# Altium project SmartHome.PrjPcb
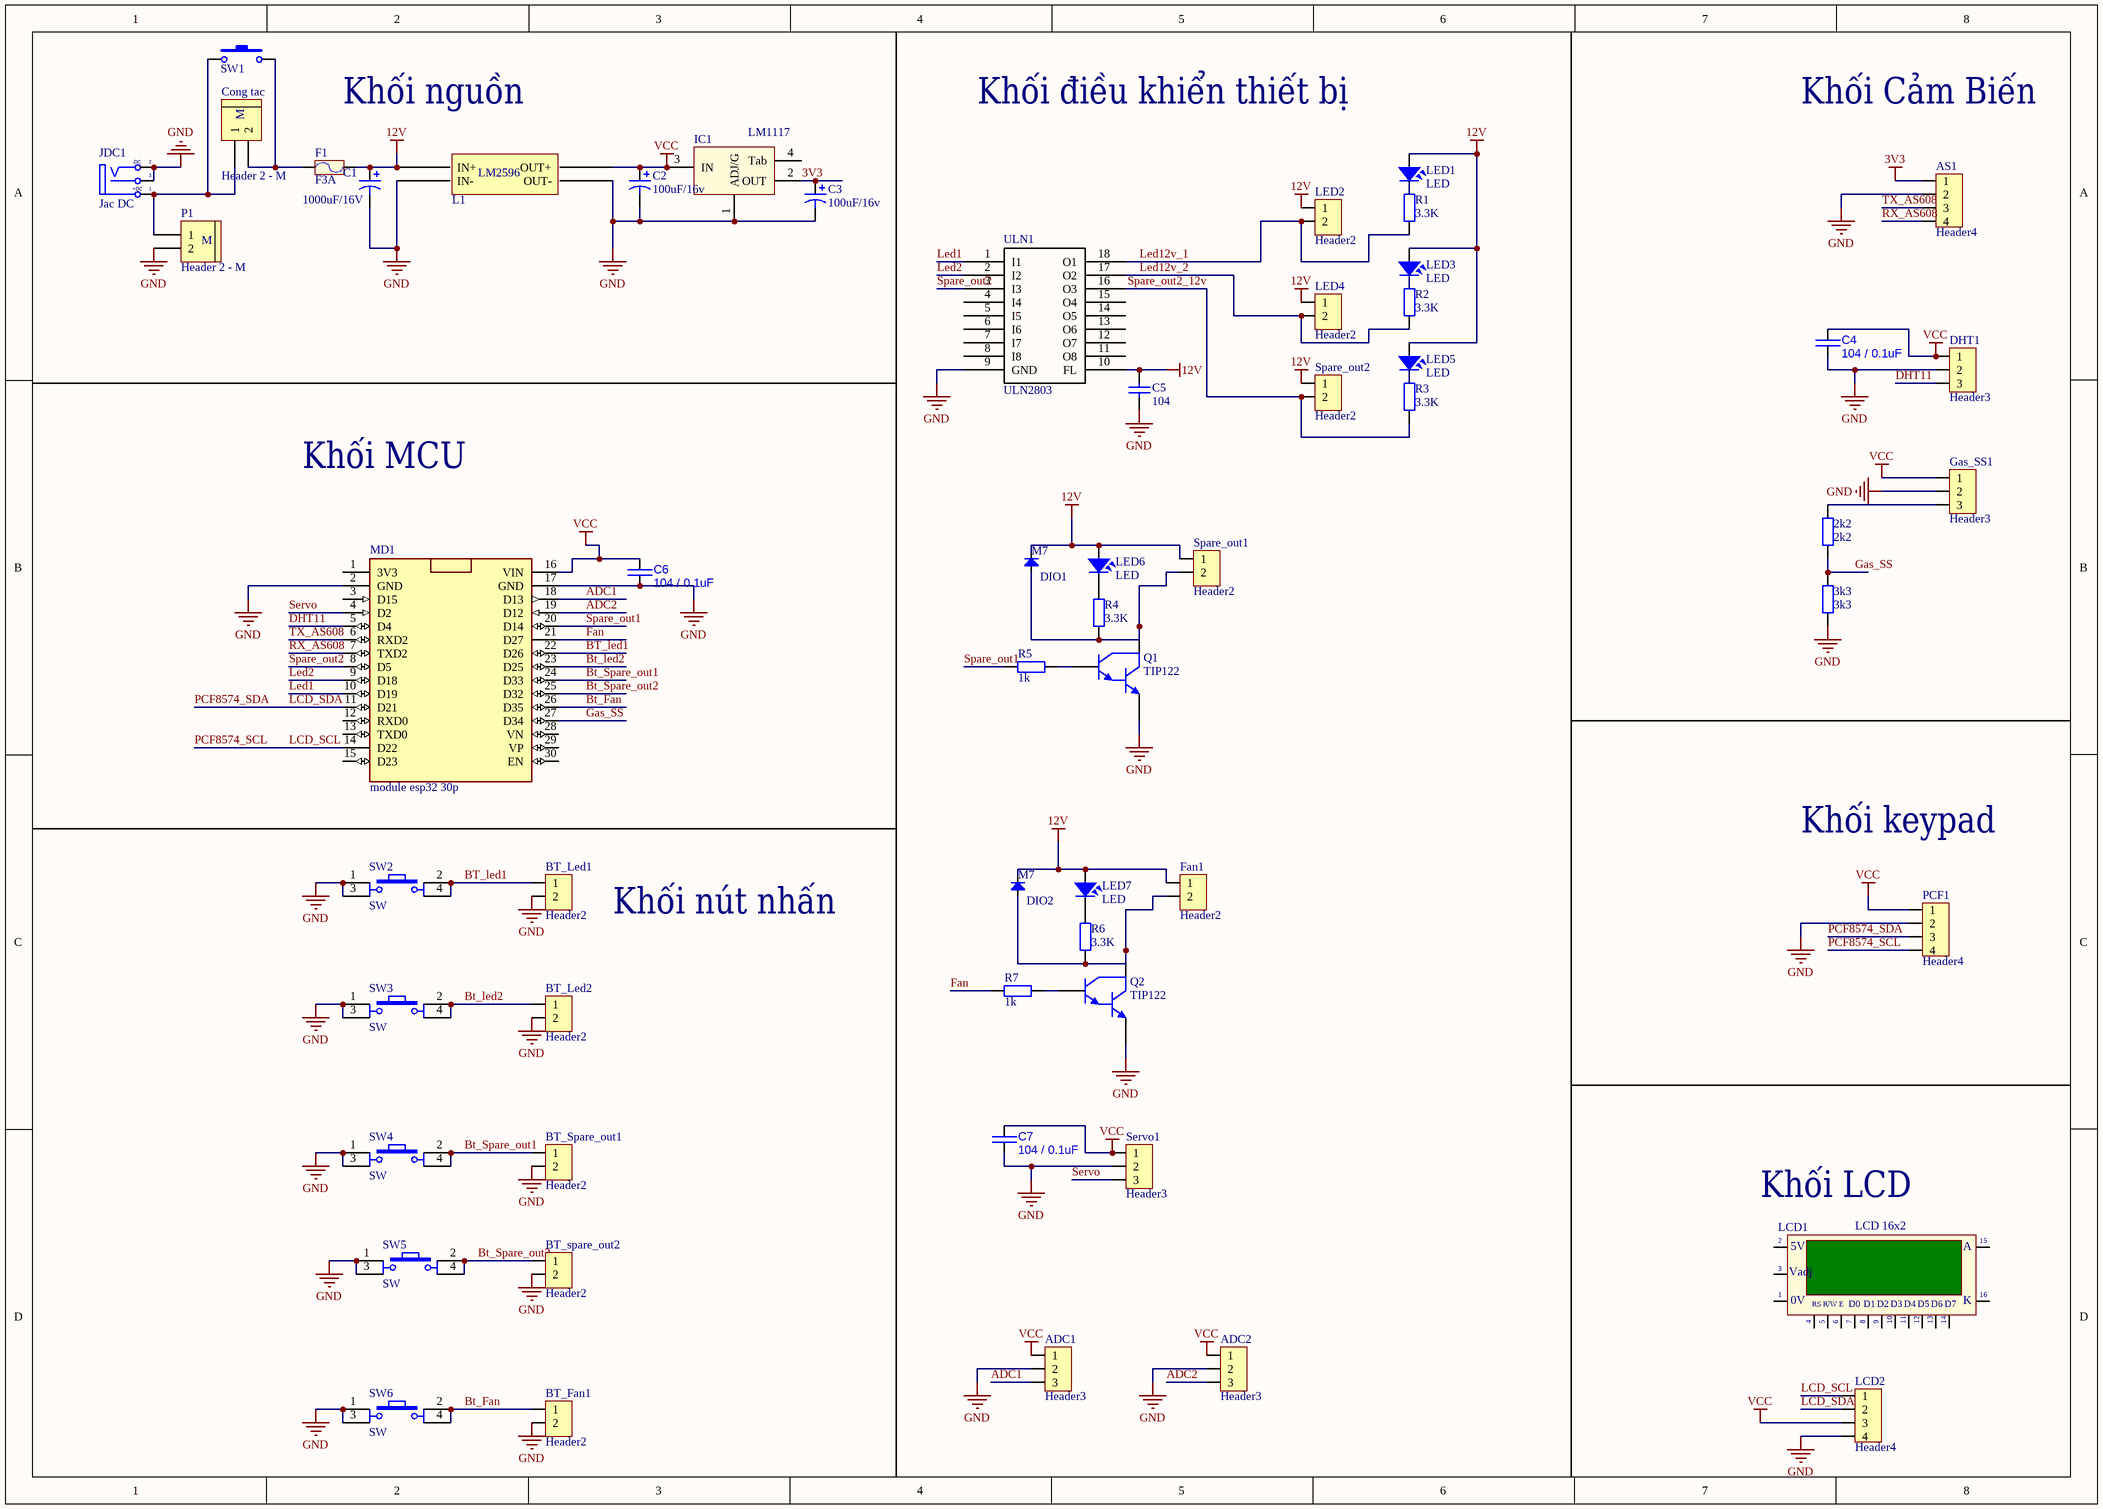
[diagram p0: SmartHome.SchDoc]
1 sheet, 58 parts. Net scope: global (net labels, ports and power ports of the same name join across sheets).
Board file: SmartHome.PcbDoc

## Sheet SmartHome.SchDoc
size A3

### Parts
2k2  2k2  [DIEN TRO 0805]
3k3  3k3  [DIEN TRO 0805]
ADC1  Header3  [Header3]
ADC2  Header3  [Header3]
AS1  Header4  [Header4]
BT_Fan1  Header2  [Header2]
BT_Led1  Header2  [Header2]
BT_Led2  Header2  [Header2]
BT_Spare_out1  Header2  [Header2]
BT_spare_out2  Header2  [Header2]
C1  1000uF/16V  [C10mm]
C2  100uF/16v  [C5mm]
C3  100uF/16v  [C5mm]
C4  value 104 / 0.1uF  [CAP_0805]  (hidden comment: approved sub OK)
C5  104  [C0805]
C6  value 104 / 0.1uF  [CAP_0805]  (hidden comment: approved sub OK)
C7  value 104 / 0.1uF  [CAP_0805]  (hidden comment: approved sub OK)
Cong_tac  Header 2 - M  [Medium - Header 2]
DHT1  Header3  [Header3]
DIO1  M7  [DIO-SMD-106]
DIO2  M7  [DIO-SMD-106]
F1  F3A  [Fuse]
Fan1  Header2  [Header2]
Gas_SS1  Header3  [Header3]
IC1  LM1117  [SOT223-4N]
JDC1  Jac DC  [DC-IN]
L1  BUCK_LM2596  [BUCK_LM2596]  (value not drawn)
LCD1  LCD 16x2  [LCD16X2N]
LCD2  Header4  [XH2.54M-4]
LED1  LED  [LED-5 GRe]
LED2  Header2  [Header2]
LED3  LED  [LED-5 GRe]
LED4  Header2  [Header2]
LED5  LED  [LED-5 GRe]
LED6  LED  [LED-5 GRe]
LED7  LED  [LED-5 GRe]
MD1  module esp32 30p  [module esp32 30 pin]
P1  Header 2 - M  [Medium - Header 2]
PCF1  Header4  [XH2.54M-4]
Q1  TIP122  [QTO-220]
Q2  TIP122  [QTO-220]
R1  3.3K  [DIEN TRO 0805]
R2  3.3K  [DIEN TRO 0805]
R3  3.3K  [DIEN TRO 0805]
R4  3.3K  [DIEN TRO 0805]
R5  1k  [DIEN TRO 0805]
R6  3.3K  [DIEN TRO 0805]
R7  1k  [DIEN TRO 0805]
Servo1  Header3  [Header3]
Spare_out1  Header2  [Header2]
Spare_out2  Header2  [Header2]
SW1  KCD01-11_SWITCH  [KCD01-11]  (value not drawn)
SW2  SW  [SW4]
SW3  SW  [SW4]
SW4  SW  [SW4]
SW5  SW  [SW4]
SW6  SW  [SW4]
ULN1  ULN2803  [DIP18/W0.3]

### Nets
3V3: AS1.1 C3.1 IC1.2(OUT)
12V: C1.1 C5.1 DIO1.2(K) DIO2.2(K) F1.2 Fan1.1 L1.1(IN+) LED1.1 LED2.1 LED3.1 LED4.1 LED5.1 LED6.1 LED7.1 Spare_out1.1 Spare_out2.1 ULN1.10(FL)
GND: 3k3.2 ADC1.2 ADC2.2 AS1.2 BT_Fan1.2 BT_Led1.2 BT_Led2.2 BT_Spare_out1.2 BT_spare_out2.2 C1.2 C2.2 C3.2 C4.1 C5.2 C6.1 C7.1 DHT1.2 Gas_SS1.2 IC1.1(ADJ/G) JDC1.2(TN) JDC1.3(S) L1.2(IN-) L1.3(OUT-) LCD2.4 MD1.2(GND) MD1.17(GND) P1.2 PCF1.2 Q1.3(E) Q2.3(E) Servo1.2 SW2.1 SW2.3 SW3.1 SW3.3 SW4.1 SW4.3 SW5.1 SW5.3 SW6.1 SW6.3 ULN1.9(GND)
VCC: ADC1.1 ADC2.1 C2.1 C4.2 C6.2 C7.2 DHT1.1 Gas_SS1.1 IC1.3(IN) L1.4(OUT+) LCD2.3 MD1.16(VIN) PCF1.1 Servo1.1
ADC1: ADC1.3 MD1.18(D13)
ADC2: ADC2.3 MD1.19(D12)
Bt_Fan: BT_Fan1.1 MD1.26(D35) SW6.2 SW6.4
BT_led1: BT_Led1.1 MD1.22(D26) SW2.2 SW2.4
Bt_led2: BT_Led2.1 MD1.23(D25) SW3.2 SW3.4
Bt_Spare_out1: BT_Spare_out1.1 MD1.24(D33) SW4.2 SW4.4
Bt_Spare_out2: BT_spare_out2.1 MD1.25(D32) SW5.2 SW5.4
DHT11: DHT1.3 MD1.5(D4)
Fan: MD1.21(D27) R7.2
Gas_SS: 2k2.2 3k3.1 MD1.27(D34)
LCD_SCL: LCD2.1 MD1.14(D22) PCF1.4  [also labelled PCF8574_SCL]
LCD_SDA: LCD2.2 MD1.11(D21) PCF1.3  [also labelled PCF8574_SDA]
Led1: MD1.10(D19) ULN1.1(I1)
Led2: MD1.9(D18) ULN1.2(I2)
Led12v_1: LED2.2 R1.2 ULN1.18(O1)
Led12v_2: LED4.2 R2.2 ULN1.17(O2)
RX_AS608: AS1.4 MD1.7(TXD2)
Servo: MD1.4(D2) Servo1.3
Spare_out1: MD1.20(D14) R5.2
Spare_out2: MD1.8(D5) ULN1.3(I3)
Spare_out2_12v: R3.2 Spare_out2.2 ULN1.16(O3)
TX_AS608: AS1.3 MD1.6(RXD2)
Net2k2_1: 2k2.1 Gas_SS1.3
NetCong_tac_1: Cong_tac.1 JDC1.1(T) P1.1 SW1.1
NetCong_tac_2: Cong_tac.2 F1.1 SW1.2
NetDIO1_1: DIO1.1(A) Q1.2(C) R4.2 Spare_out1.2
NetDIO2_1: DIO2.1(A) Fan1.2 Q2.2(C) R6.2
NetLED1_2: LED1.2 R1.1
NetLED3_2: LED3.2 R2.1
NetLED5_2: LED5.2 R3.1
NetLED6_2: LED6.2 R4.1
NetLED7_2: LED7.2 R6.1
NetQ1_1: Q1.1(B) R5.1
NetQ2_1: Q2.1(B) R7.1

Not connected (* = marked no-connect by the designer): IC1 4(Tab); LCD1 1(GND) 2(VDD) 3(VAdj) 4(RS) 5(R/~{W}) 6(~{EN}) 7(D0) 8(D1) 9(D2) 10(D3) 11(D4) 12(D5) 13(D6) 14(D7) 15(A) 16(K); MD1 1(3V3) 3(D15) 12(RXD0) 13(TXD0) 15(D23) 28(VN) 29(VP) 30(EN); ULN1 4(I4) 5(I5) 6(I6) 7(I7) 8(I8) 11(O8) 12(O7) 13(O6) 14(O5) 15(O4)

### Notes on the sheet
- Khối nguồn
- Khối điều khiển thiết bị
- Khối Cảm Biến
- Khối MCU
- Khối keypad
- Khối nút nhấn
- (near LCD1) Khối LCD
- (in symbol BUCK_LM2596) LM2596
- (in symbol DCIN) -DC; +DC
- (in symbol Header 2 - M) M
- (in symbol LCD) 5V; Vadj; |; 0V; R/W; E

### Library data of the parts
2k2 3k3 R1-R7 = R0805: Resistor SMD 0805; Published: 8-Jun-2000; LatestRevisionDate: 17-Jul-2002; LatestRevisionNote: Re-released for DXP Platform.; PackageReference: AXIAL-0.4; Publisher: Altium Limited
ADC1 ADC2 DHT1 Gas_SS1 Servo1 = Header3: Header IDC, 3 x 1 Pin Vertical 2.54mm Pitch (Non-Boxed, Male); Manufacturer: W¨¹rth Elektronik eiSos GmbH; partNo: 613002143121; ComponentLink1 Description: Manufacturer; ComponentLink2 Description: Datasheet; NoPins: 02; Created Date: 29 March 2013; ComponentLink1URL: http://www.we-online.com; ComponentLink2URL: http://katalog.we-online.de/em/datasheet/6130xx143121.pdf; Created by: Karrer Zheng
AS1 LCD2 PCF1 = Header4: Header IDC, 4 x 1 Pin Vertical 2.54mm Pitch (Non-Boxed, Male); Manufacturer: W¨¹rth Elektronik eiSos GmbH; partNo: 613002143121; ComponentLink1 Description: Manufacturer; ComponentLink2 Description: Datasheet; NoPins: 02; Created Date: 29 March 2013; ComponentLink1URL: http://www.we-online.com; ComponentLink2URL: http://katalog.we-online.de/em/datasheet/6130xx143121.pdf; Created by: Karrer Zheng
BT_Fan1 BT_Led1 BT_Led2 BT_Spare_out1 BT_spare_out2 Fan1 LED2 LED4 Spare_out1 Spare_out2 = Header2: Header IDC, 2 x 1 Pin Vertical 2.54mm Pitch (Non-Boxed, Male); Manufacturer: W¨¹rth Elektronik eiSos GmbH; partNo: 613002143121; ComponentLink1 Description: Manufacturer; ComponentLink2 Description: Datasheet; NoPins: 02; Created Date: 29 March 2013; ComponentLink1URL: http://www.we-online.com; ComponentLink2URL: http://katalog.we-online.de/em/datasheet/6130xx143121.pdf; Created by: Karrer Zheng
C1 = Cap Pol 12mm: Polarized Capacitor (Axial); Published: 8-Jun-2000; LatestRevisionDate: 17-Jul-2002; LatestRevisionNote: Re-released for DXP Platform.; PackageReference: POLAR0.8; Publisher: Altium Limited
C2 C3 = Cap Pol 5mm: Polarized Capacitor (Axial); Published: 8-Jun-2000; LatestRevisionDate: 17-Jul-2002; LatestRevisionNote: Re-released for DXP Platform.; PackageReference: POLAR0.8; Publisher: Altium Limited
C4 C6 C7 = CAP C_0805: Capacitor SMD Cer 1.8nF 10% 50V X7R 0805; Manufacturer 1: AVX Corporation; Manufacturer Part Number 1: 08055C182KAT2A; Ratings: 50V; X7R; SCDType: source*; Tolerance: ±10%; Operating Temperature: -55°C ~ 125°C; Package / Case: 0805 (2012 metric); Supplier 1: Digi-Key; Supplier Part Number 1: 478-1374-1-ND
C5 = CapSMD: Capacitor; Value: 33p; Published: 8-Jun-2000; LatestRevisionDate: 17-Jul-2002; LatestRevisionNote: Re-released for DXP Platform.; PackageReference: RAD-0.3; Publisher: Altium Limited
Cong_tac P1 = Header 2 - M: Header, 2-Pin, Medium; LatestRevisionDate: 17-Jul-2002; LatestRevisionNote: Re-released for DXP Platform.; Publisher: Altium Limited
DIO1 DIO2 = Diode SMD: Default Diode; Code - JEDEC: DO-214-AB; Value: 1N5007; Published: 8-Jun-2000; Revision: July-2002: Re-released for DXP Platform.; Publisher: Altium Limited
F1 = Fuse: Designed by: VanDungEvn; Value: Fuse
IC1 = LM1117: 3v3; Value: LM317
JDC1 = DCIN: Jac DC input; Value: Jac DC
LCD1 = LCD
LED1 LED3 LED5-LED7 = LED: LED Single colour Green and Red; Value: LED 3 ly Single Colour
Q1 Q2 = TIP122: Darlington Silicon Power NPN Transistor, 8 Amp, 100 Volts and 65 Watts
SW1 = KCD01-11_SWITCH: Nut Nhan 2 Chan SMD 3x6x2.5; Ma_Hang: MH001036; Ten: Nút Nhấn 2 Chân 3x6x2.5MM SMD
SW2-SW6 = SW4: Switch button 4 pin; Value: Button chip 4 pin
ULN1 = ULN2803: OCTAL HIGH CURRENT DRIVER; Manufacturer: Texas Instruments; Manufacturer Part Number: ULN2803ADWR; Number of Drivers/Receivers: 8/0; Voltage - Supply: 5V; Supplier 1: Digi-Key; Supplier Part Number 1: 296-15777-1-ND; Packaging: Cut Tape (CT); Supplier Part Number: 296-15777-1-ND; Type: Darlington Array; Supplier: Digi-Key; Protocol: -; Package / Case: 18-SOIC (7.5mm Width); Category: Integrated Circuits (ICs); RoHS: RoHS Compliant